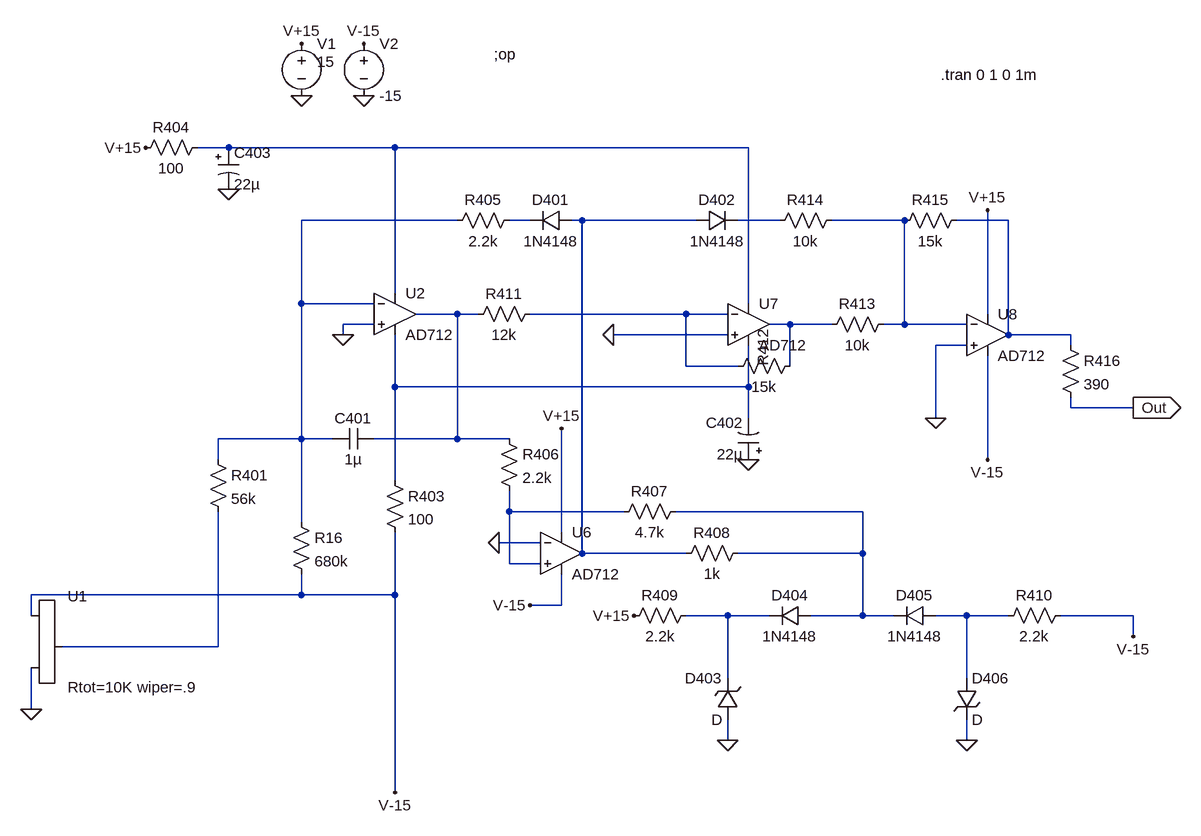
[diagram p0: schematic TimeBase_top_half.asc]
TimeBase_top_half.asc, the LTspice schematic file:
Version 4
SHEET 1 1644 2012
WIRE -144 144 -192 144
WIRE 112 144 -144 144
WIRE 656 144 112 144
WIRE 208 256 -32 256
WIRE 320 256 288 256
WIRE 400 256 384 256
WIRE 576 256 400 256
WIRE 704 256 640 256
WIRE 896 256 784 256
WIRE 1056 256 976 256
WIRE 112 368 112 144
WIRE -32 384 -32 256
WIRE 80 384 -32 384
WIRE 656 384 656 144
WIRE 208 400 144 400
WIRE 240 400 208 400
WIRE 560 400 320 400
WIRE 624 400 560 400
WIRE 1024 400 1024 240
WIRE 80 416 32 416
WIRE 720 416 688 416
WIRE 784 416 720 416
WIRE 896 416 896 256
WIRE 896 416 864 416
WIRE 992 416 896 416
WIRE 32 432 32 416
WIRE 624 432 448 432
WIRE 1056 432 1056 256
WIRE 1152 432 1056 432
WIRE 992 448 944 448
WIRE 1152 448 1152 432
WIRE 560 480 560 400
WIRE 640 480 560 480
WIRE 720 480 720 416
WIRE 112 512 112 432
WIRE 656 512 656 448
WIRE 656 512 112 512
WIRE 1152 544 1152 528
WIRE 1248 544 1152 544
WIRE 656 560 656 512
WIRE 944 560 944 448
WIRE -32 592 -32 384
WIRE -32 592 -160 592
WIRE 16 592 -32 592
WIRE 208 592 208 400
WIRE 208 592 80 592
WIRE 288 592 208 592
WIRE -160 624 -160 592
WIRE 1024 624 1024 464
WIRE 112 656 112 512
WIRE 288 704 288 672
WIRE 464 704 288 704
WIRE 832 704 544 704
WIRE -32 720 -32 592
WIRE 368 736 368 576
WIRE 336 752 272 752
WIRE 400 768 400 256
WIRE 560 768 400 768
WIRE 832 768 832 704
WIRE 832 768 640 768
WIRE 288 784 288 704
WIRE 336 784 288 784
WIRE -32 832 -32 800
WIRE -32 832 -448 832
WIRE 112 832 112 736
WIRE 112 832 -32 832
WIRE 368 848 368 800
WIRE 368 848 320 848
WIRE -448 864 -448 832
WIRE 624 864 560 864
WIRE 688 864 624 864
WIRE 832 864 832 768
WIRE 832 864 752 864
WIRE 880 864 832 864
WIRE 992 864 944 864
WIRE 1056 864 992 864
WIRE 1248 864 1136 864
WIRE 1248 896 1248 864
WIRE -160 912 -160 704
WIRE -160 912 -400 912
WIRE 624 960 624 864
WIRE 992 960 992 864
WIRE -448 1008 -448 944
WIRE 624 1056 624 1024
WIRE 992 1056 992 1024
WIRE 112 1136 112 832
FLAG -32 64 0
FLAG 64 64 0
FLAG -32 -16 V+15
FLAG 64 -16 V-15
FLAG -272 144 V+15
FLAG -144 208 0
FLAG 448 432 0
FLAG 944 560 0
FLAG 1024 240 V+15
FLAG 1024 624 V-15
FLAG 272 752 0
FLAG 1248 896 V-15
FLAG 480 864 V+15
FLAG 624 1056 0
FLAG 992 1056 0
FLAG 112 1136 V-15
FLAG -448 1008 0
FLAG 320 848 V-15
FLAG 368 576 V+15
FLAG 656 624 0
FLAG 1248 544 Out
IOPIN 1248 544 Out
FLAG 32 432 0
SYMBOL voltage -32 -32 R0
WINDOW 3 24 44 Left 2
WINDOW 123 0 0 Left 0
WINDOW 39 0 0 Left 0
SYMATTR Value 15
SYMATTR InstName V1
SYMBOL voltage 64 -32 R0
WINDOW 123 0 0 Left 0
WINDOW 39 0 0 Left 0
SYMATTR InstName V2
SYMATTR Value -15
SYMBOL res 336 384 R90
WINDOW 0 0 56 VBottom 2
WINDOW 3 32 56 VTop 2
SYMATTR InstName R411
SYMATTR Value 12k
SYMBOL res -176 128 R90
WINDOW 0 0 56 VBottom 2
WINDOW 3 32 56 VTop 2
SYMATTR InstName R404
SYMATTR Value 100
SYMBOL polcap -160 144 R0
SYMATTR InstName C403
SYMATTR Value 22µ
SYMBOL res 880 400 R90
WINDOW 0 0 56 VBottom 2
WINDOW 3 32 56 VTop 2
SYMATTR InstName R413
SYMATTR Value 10k
SYMBOL res 304 240 R90
WINDOW 0 0 56 VBottom 2
WINDOW 3 32 56 VTop 2
SYMATTR InstName R405
SYMATTR Value 2.2k
SYMBOL res 800 240 R90
WINDOW 0 0 56 VBottom 2
WINDOW 3 32 56 VTop 2
SYMATTR InstName R414
SYMATTR Value 10k
SYMBOL res 992 240 R90
WINDOW 0 0 56 VBottom 2
WINDOW 3 32 56 VTop 2
SYMATTR InstName R415
SYMATTR Value 15k
SYMBOL diode 384 240 R90
WINDOW 0 0 32 VBottom 2
WINDOW 3 32 32 VTop 2
SYMATTR InstName D401
SYMATTR Value 1N4148
SYMBOL diode 576 272 R270
WINDOW 0 32 32 VTop 2
WINDOW 3 0 32 VBottom 2
SYMATTR InstName D402
SYMATTR Value 1N4148
SYMBOL diode 752 848 R90
WINDOW 0 0 32 VBottom 2
WINDOW 3 32 32 VTop 2
SYMATTR InstName D404
SYMATTR Value 1N4148
SYMBOL diode 944 848 R90
WINDOW 0 0 32 VBottom 2
WINDOW 3 32 32 VTop 2
SYMATTR InstName D405
SYMATTR Value 1N4148
SYMBOL res 576 848 R90
WINDOW 0 0 56 VBottom 2
WINDOW 3 32 56 VTop 2
SYMATTR InstName R409
SYMATTR Value 2.2k
SYMBOL res 1152 848 R90
WINDOW 0 0 56 VBottom 2
WINDOW 3 32 56 VTop 2
SYMATTR InstName R410
SYMATTR Value 2.2k
SYMBOL zener 640 1024 R180
WINDOW 0 24 64 Left 2
WINDOW 3 24 0 Left 2
SYMATTR InstName D403
SYMBOL zener 976 960 R0
SYMATTR InstName D406
SYMBOL cap 80 576 R90
WINDOW 0 0 32 VBottom 2
WINDOW 3 32 32 VTop 2
SYMATTR InstName C401
SYMATTR Value 1µ
SYMBOL res 272 576 R0
SYMATTR InstName R406
SYMATTR Value 2.2k
SYMBOL res 560 688 R90
WINDOW 0 0 56 VBottom 2
WINDOW 3 32 56 VTop 2
SYMATTR InstName R407
SYMATTR Value 4.7k
SYMBOL polcap 672 624 R180
WINDOW 0 24 57 Left 2
WINDOW 3 24 8 Left 2
SYMATTR InstName C402
SYMATTR Value 22µ
SYMBOL res -176 608 R0
SYMATTR InstName R401
SYMATTR Value 56k
SYMBOL res 1136 432 R0
SYMATTR InstName R416
SYMATTR Value 390
SYMBOL res 96 640 R0
SYMATTR InstName R403
SYMATTR Value 100
SYMBOL res -48 704 R0
SYMATTR InstName R16
SYMATTR Value 680k
SYMBOL res 736 464 R90
WINDOW 0 -13 42 Top 2
WINDOW 3 32 56 VTop 2
SYMATTR InstName R412
SYMATTR Value 15k
SYMBOL OpAmps\\AD712 368 704 R0
SYMATTR InstName U6
SYMBOL OpAmps\\AD712 656 352 R0
SYMATTR InstName U7
SYMBOL OpAmps\\AD712 1024 368 R0
SYMATTR InstName U8
SYMBOL potentiometer_standard -464 848 R0
SYMATTR InstName U1
SYMATTR Value Rtot=10K wiper=.9
SYMBOL res 656 752 R90
WINDOW 0 0 56 VBottom 2
WINDOW 3 32 56 VTop 2
SYMATTR InstName R408
SYMATTR Value 1k
SYMBOL OpAmps\\AD712 112 336 R0
SYMATTR InstName U2
TEXT 264 0 Left 2 !;op
TEXT 952 32 Left 2 !.tran 0 1 0 1m

The netlist it stands for:
* TimeBase_top_half.asc
V1 V+15 0 15
V2 V-15 0 -15
R411 N009 N008 12k
R404 N001 V+15 100
C403 N001 0 22µ
R413 N006 N010 10k
R405 N003 N002 2.2k
R414 N006 N005 10k
R415 N007 N006 15k
D401 N004 N003 1N4148
D402 N004 N005 1N4148
D404 N013 N014 1N4148
D405 N015 N013 1N4148
R409 N014 V+15 2.2k
R410 V-15 N015 2.2k
D403 0 N014 D
D406 N015 0 D
C401 N008 N002 1µ
R406 N008 N012 2.2k
R407 N013 N012 4.7k
C402 0 N011 22µ
R401 N002 N016 56k
R416 N007 Out 390
R403 N011 V-15 100
R16 N002 V-15 680k
R412 N010 N009 15k
XU6 N012 0 V+15 V-15 N004 AD712  ; pins In+ In- V+ V- OUT
XU7 0 N009 N001 N011 N010 AD712  ; pins In+ In- V+ V- OUT
XU8 0 N006 V+15 V-15 N007 AD712  ; pins In+ In- V+ V- OUT
XU1 V-15 0 N016 Rtot=10K wiper=.9
R408 N013 N004 1k
XU2 0 N002 N001 N011 N008 AD712  ; pins In+ In- V+ V- OUT
.model D D
.lib standard.dio
;op
.tran 0 1 0 1m
.backanno
.end